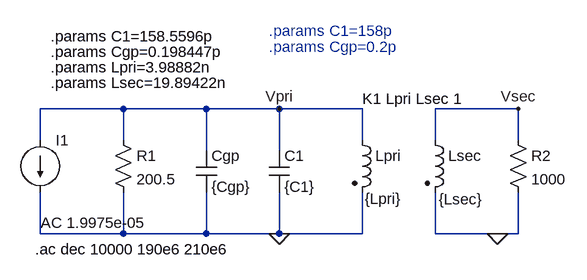
[diagram p0: schematic Ej1.1_Adap2.asc]
Ej1.1_Adap2.asc, the LTspice schematic file:
Version 4
SHEET 1 880 680
WIRE -16 64 -144 64
WIRE 112 64 -16 64
WIRE 224 64 112 64
WIRE 352 64 224 64
WIRE 592 64 464 64
WIRE -144 112 -144 64
WIRE -16 112 -16 64
WIRE 352 112 352 64
WIRE 464 112 464 64
WIRE 592 112 592 64
WIRE 112 128 112 64
WIRE 224 128 224 64
WIRE -144 256 -144 192
WIRE -16 256 -16 192
WIRE -16 256 -144 256
WIRE 112 256 112 192
WIRE 112 256 -16 256
WIRE 224 256 224 192
WIRE 224 256 112 256
WIRE 352 256 352 192
WIRE 352 256 224 256
WIRE 464 256 464 192
WIRE 560 256 464 256
WIRE 592 256 592 192
WIRE 592 256 560 256
FLAG 224 256 0
FLAG 560 256 0
FLAG 592 64 Vsec
FLAG 224 64 Vpri
SYMBOL cap 96 128 R0
SYMATTR InstName Cgp
SYMATTR Value {Cgp}
SYMBOL res -32 96 R0
SYMATTR InstName R1
SYMATTR Value 200.5
SYMBOL cap 208 128 R0
SYMATTR InstName C1
SYMATTR Value {C1}
SYMBOL ind2 336 96 R0
WINDOW 3 20 106 Left 2
SYMATTR InstName Lpri
SYMATTR Value {Lpri}
SYMATTR Type ind
SYMBOL ind2 448 96 R0
WINDOW 3 22 107 Left 2
SYMATTR InstName Lsec
SYMATTR Value {Lsec}
SYMATTR Type ind
SYMBOL res 576 96 R0
SYMATTR InstName R2
SYMATTR Value 1000
SYMBOL current -144 112 R0
WINDOW 123 1 127 Left 2
WINDOW 39 0 0 Left 0
SYMATTR InstName I1
SYMATTR Value ""
SYMATTR Value2 AC 1.9975e-05
TEXT -152 280 Left 2 !.ac dec 10000 190e6 210e6
TEXT 352 48 Left 2 !K1 Lpri Lsec 1
TEXT -128 -48 Left 2 !.params C1=158.5596p
TEXT -128 -24 Left 2 !.params Cgp=0.198447p
TEXT -128 0 Left 2 !.params Lpri=3.98882n
TEXT -128 24 Left 2 !.params Lsec=19.89422n
TEXT 208 -56 Left 2 ;.params C1=158p
TEXT 208 -32 Left 2 ;.params Cgp=0.2p

The netlist it stands for:
* Ej1.1_Adap2.asc
Cgp Vpri 0 {Cgp}
R1 Vpri 0 200.5
C1 Vpri 0 {C1}
Lpri Vpri 0 {Lpri}
Lsec Vsec 0 {Lsec}
R2 Vsec 0 1000
I1 Vpri 0 AC 1.9975e-05
.ac dec 10000 190e6 210e6
K1 Lpri Lsec 1
.params C1=158.5596p
.params Cgp=0.198447p
.params Lpri=3.98882n
.params Lsec=19.89422n
* .params C1=158p
* .params Cgp=0.2p
.backanno
.end

* Results of the author's LTspice run, read from the files saved beside the schematic
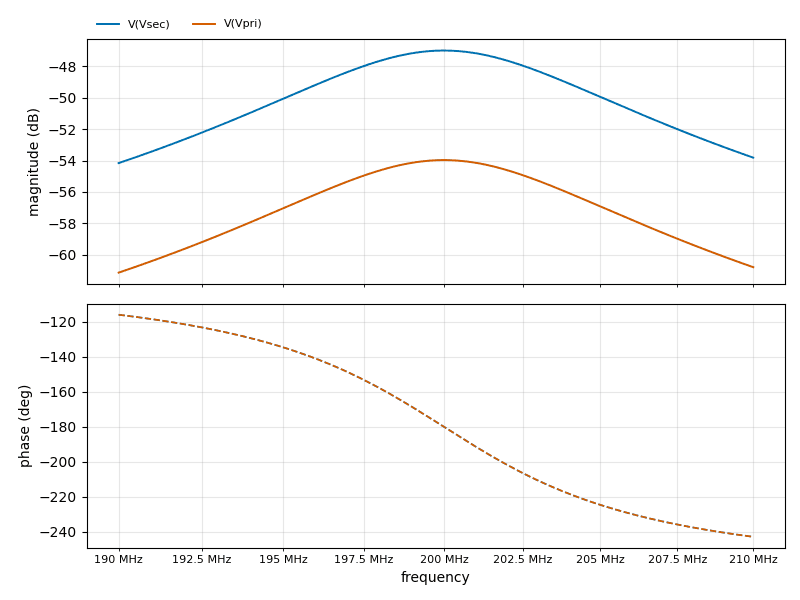
[diagram p1: AC Analysis of Ej1.1_Adap2.asc, plotted from the saved traces]
* AC Analysis, 1 run:
*   V(Vsec): -54.16 dB at 190 MHz, -53.81 dB at 210 MHz, peak -46.99 dB at 200 MHz, 3 dB below the peak at 195.1 MHz and 205.1 MHz
*   V(Vpri): -61.14 dB at 190 MHz, -60.79 dB at 210 MHz, peak -53.97 dB at 200 MHz, 3 dB below the peak at 195.1 MHz and 205.1 MHz